# EAGLE design tb_project_arduino_pro_mini_proto_revA (EAGLE 7.6.0)
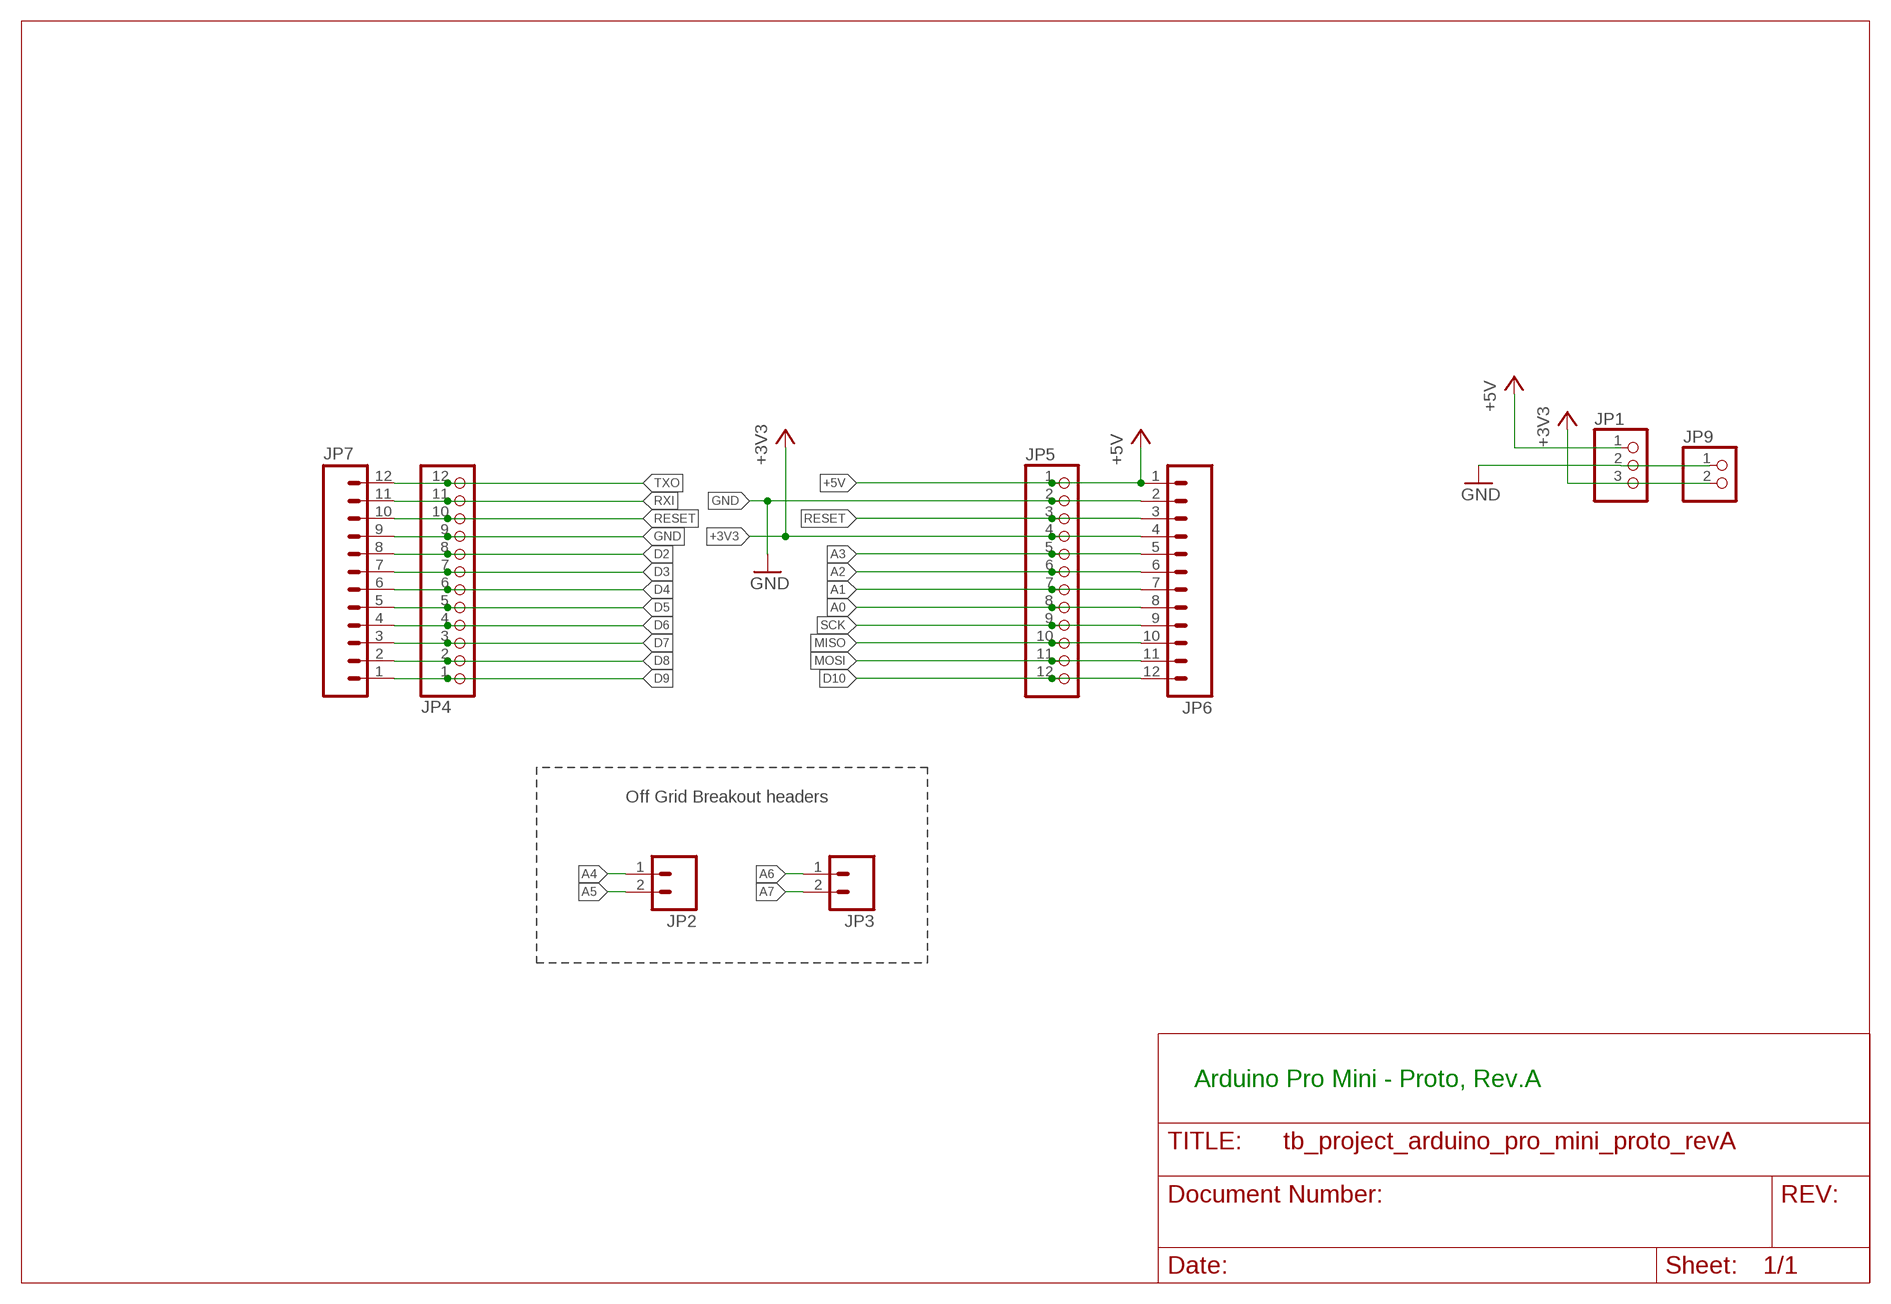
[diagram p0: schematic, sheet 1]

## Parts
JP1  PINHD-1X3  [1X03]
JP2  M02PTH  [1X02]
JP3  M02PTH  [1X02]
JP4  PINHD-1X12  [1X12]
JP5  PINHD-1X12  [1X12]
JP6  M12PTH  [1X12]
JP7  M12PTH  [1X12]
JP9  PINHD-1X2  [1X02]

## Nets
+3V3: JP1.3 JP5.4 JP6.4 JP9.2
+5V: JP1.1 JP5.1 JP6.1
A0: JP5.8 JP6.8
A1: JP5.7 JP6.7
A2: JP5.6 JP6.6
A3: JP5.5 JP6.5
A4: JP2.1
A5: JP2.2
A6: JP3.1
A7: JP3.2
D2: JP4.8 JP7.8
D3: JP4.7 JP7.7
D4: JP4.6 JP7.6
D5: JP4.5 JP7.5
D6: JP4.4 JP7.4
D7: JP4.3 JP7.3
D8: JP4.2 JP7.2
D9: JP4.1 JP7.1
D10: JP5.12 JP6.12
GND [vcc]: JP1.2 JP4.9 JP5.2 JP6.2 JP7.9 JP9.1
MISO: JP5.10 JP6.10
MOSI: JP5.11 JP6.11
RESET: JP4.10 JP5.3 JP6.3 JP7.10
RXI: JP4.11 JP7.11
SCK: JP5.9 JP6.9
TXO: JP4.12 JP7.12

## Notes on the sheet
- Off Grid Breakout headers
- Arduino Pro Mini - Proto, Rev.A

## Library data of the parts
JP1 = pinhead:PINHD-1X3: PIN HEADER
JP2 JP3 = SparkFun:M02: Header 2 Standard 2-pin 0.1" header. Use with straight break away headers (SKU : PRT-00116), right angle break away headers (PRT-00553), swiss pins (PRT-00743), machine pins (PRT-00117), and female headers (PRT-00115). Molex polarized connector foot print use with SKU : PRT-08233 with associated crimp pins and housings.
JP4 JP5 = pinhead:PINHD-1X12: PIN HEADER
JP6 JP7 = SparkFun:M12: Header 12 Standard 12-pin 0.1" header. Use with straight break away headers (SKU : PRT-00116), right angle break away headers (PRT-00553), swiss pins (PRT-00743), machine pins (PRT-00117), and female headers (PRT-00115).
JP9 = pinhead:PINHD-1X2: PIN HEADER

## Net classes
1 vcc: width 0.254 mm

## Board
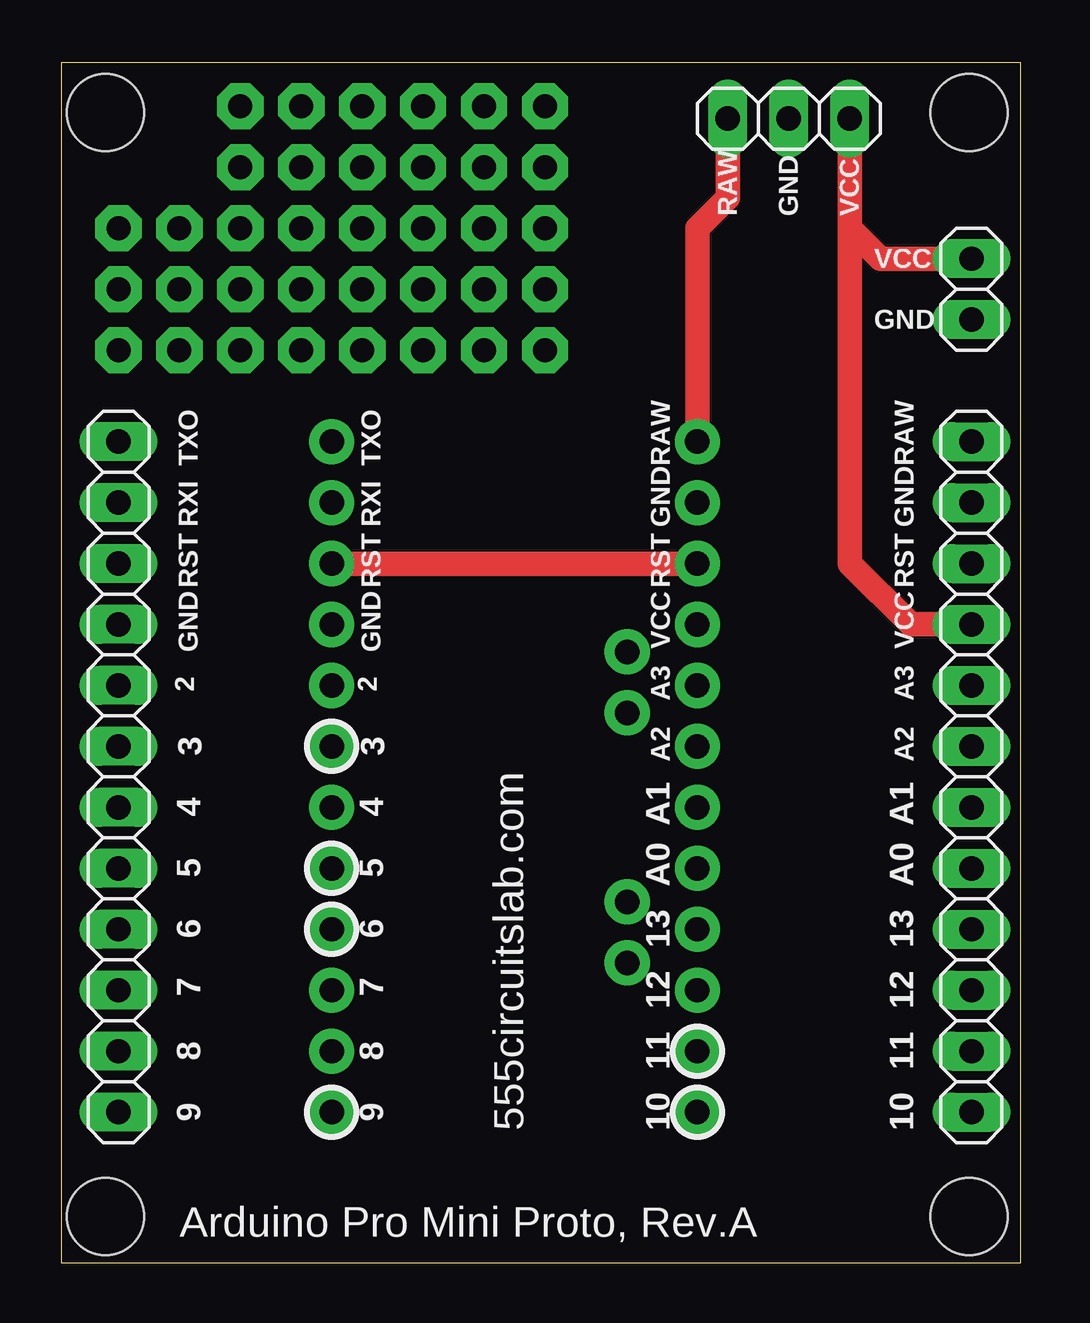
[diagram p1: board, top side]
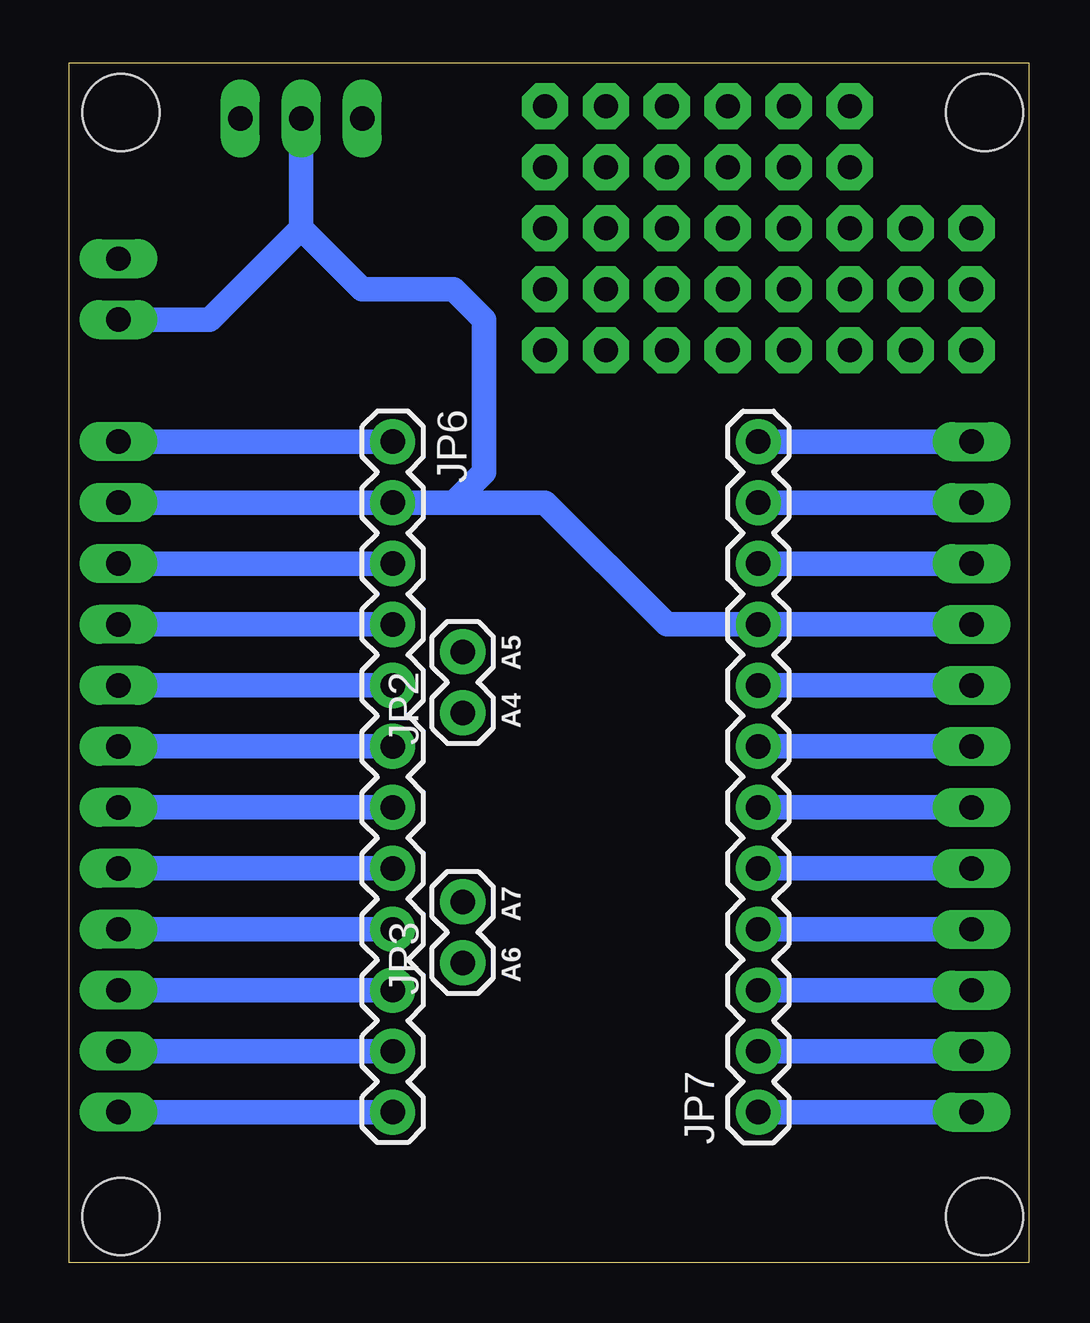
[diagram p2: board, bottom side, seen from below]

Size 40 x 50 mm. Coordinates in mm from the lower left corner, seen from the top.
Outline: 0,0 40,0 40,50 0,50 0,0
Copper layers (1*16): Top 0.035mm / dielectric 1.5mm / Bottom 0.035mm
Design rules "SparkFun-2-layer *": minimum track width 7mil, minimum drill 15mil, track to track 8mil, track to pad 8mil, pad to pad 8mil, via to via 8mil, smd to smd 8mil, copper to edge 8mil, drill to drill 8mil, minimum pad ring 12mil, minimum via ring 10mil, stop-mask expansion 4mil, vias tented up to drill 20mil, thermal gap 10mil
Holes 3.2 mm at 1.84,1.92 37.84,1.92 1.84,47.92 37.84,47.92

### Footprints (pad centres in the part's own frame; a part is rotated, then mirrored left to right if it is on the bottom)
1X03 = drill 1.016 long: 1 -2.54,0; 2 0,0; 3 2.54,0
1X02 = drill 1.016 pad 1.88: 1 0,0; 2 2.54,0
1X12 = drill 1.016 long: 1 -13.97,0; 2 -11.43,0; 3 -8.89,0; 4 -6.35,0; 5 -3.81,0; 6 -1.27,0; 7 1.27,0; 8 3.81,0; 9 6.35,0; 10 8.89,0; 11 11.43,0; 12 13.97,0
1X12' = drill 1.016 pad 1.88: 1 0,0; 2 2.54,0; 3 5.08,0; 4 7.62,0; 5 10.16,0; 6 12.7,0; 7 15.24,0; 8 17.78,0; 9 20.32,0; 10 22.86,0; 11 25.4,0; 12 27.94,0
1X02' = drill 1.016 long: 1 -1.27,0; 2 1.27,0

### Placement (x,y rotation side)
JP1  30.32,47.67 0 top
JP2  23.59,22.91 90 bottom
JP3  23.59,12.49 90 bottom
JP4  2.38,20.24 90 top
JP5  37.94,20.24 270 top
JP6  [1X12']  26.51,34.21 270 bottom
JP7  [1X12']  11.27,6.27 90 bottom
JP9  [1X02']  37.94,40.56 90 top

### Tracks (layer width: path | path; a pad name or v marks a point on that pad's centre or on a via)
+3V3
  Top 1.016: JP1.3 32.86,43.1 | 32.86,43.1 32.86,29.13 35.4,26.59 JP5.4 | JP9.2 34.13,41.83 32.86,43.1
  Bottom 1.016: JP6.4 JP5.4
+5V
  Top 1.016: JP1.1 27.78,44.37 26.51,43.1 JP6.1
  Bottom 1.016: JP6.1 JP5.1
A0
  Bottom 1.016: JP6.8 JP5.8
A1
  Bottom 1.016: JP6.7 JP5.7
A2
  Bottom 1.016: JP6.6 JP5.6
A3
  Bottom 1.016: JP6.5 JP5.5
D2
  Bottom 1.016: JP4.8 JP7.8
D3
  Bottom 1.016: JP4.7 JP7.7
D4
  Bottom 1.016: JP4.6 JP7.6
D5
  Bottom 1.016: JP4.5 JP7.5
D6
  Bottom 1.016: JP4.4 JP7.4
D7
  Bottom 1.016: JP4.3 JP7.3
D8
  Bottom 1.016: JP4.2 JP7.2
D9
  Bottom 1.016: JP4.1 JP7.1
D10
  Bottom 1.016: JP5.12 JP6.12
GND
  Bottom 1.016: JP4.9 JP7.9 15.08,26.59 20.16,31.67 23.97,31.67 | JP5.2 JP6.2 23.97,31.67 | JP1.2 30.32,43.1 | 30.32,43.1 27.78,40.56 23.97,40.56 22.7,39.29 22.7,32.94 23.97,31.67 | 30.32,43.1 34.13,39.29 JP9.1
MISO
  Bottom 1.016: JP6.10 JP5.10
MOSI
  Bottom 1.016: JP6.11 JP5.11
N$1  (via drill 1 pad 1.93)
  other vias: 7.46,45.64
N$2  (via drill 1 pad 1.93)
  other vias: 7.46,43.1
N$3  (via drill 1 pad 1.93)
  other vias: 10,40.56
N$4  (via drill 1 pad 1.93)
  other vias: 10,38.02
N$5  (via drill 1 pad 1.93)
  other vias: 12.54,38.02
N$6  (via drill 1 pad 1.93)
  other vias: 12.54,40.56
N$7  (via drill 1 pad 1.93)
  other vias: 12.54,43.1
N$8  (via drill 1 pad 1.93)
  other vias: 10,43.1
N$9  (via drill 1 pad 1.93)
  other vias: 10,45.64
N$10  (via drill 1 pad 1.93)
  other vias: 7.46,48.18
N$11  (via drill 1 pad 1.93)
  other vias: 10,48.18
N$12  (via drill 1 pad 1.93)
  other vias: 12.54,45.64
N$13  (via drill 1 pad 1.93)
  other vias: 12.54,48.18
N$14  (via drill 1 pad 1.93)
  other vias: 15.08,45.64
N$15  (via drill 1 pad 1.93)
  other vias: 15.08,48.18
N$16  (via drill 1 pad 1.93)
  other vias: 20.16,40.56
N$17  (via drill 1 pad 1.93)
  other vias: 20.16,48.18
N$18  (via drill 1 pad 1.93)
  other vias: 20.16,45.64
N$19  (via drill 1 pad 1.93)
  other vias: 20.16,43.1
N$20  (via drill 1 pad 1.93)
  other vias: 20.16,38.02
N$21  (via drill 1 pad 1.93)
  other vias: 15.08,38.02
N$22  (via drill 1 pad 1.93)
  other vias: 17.62,38.02
N$23  (via drill 1 pad 1.93)
  other vias: 15.08,40.56
N$24  (via drill 1 pad 1.93)
  other vias: 17.62,40.56
N$25  (via drill 1 pad 1.93)
  other vias: 15.08,43.1
N$26  (via drill 1 pad 1.93)
  other vias: 17.62,43.1
N$27  (via drill 1 pad 1.93)
  other vias: 17.62,45.64
N$119  (via drill 1 pad 1.93)
  other vias: 17.62,48.18
N$124  (via drill 1 pad 1.93)
  other vias: 4.92,40.56
N$125  (via drill 1 pad 1.93)
  other vias: 4.92,43.1
N$126  (via drill 1 pad 1.93)
  other vias: 2.38,40.56
N$127  (via drill 1 pad 1.93)
  other vias: 2.38,43.1
N$144  (via drill 1 pad 1.93)
  other vias: 2.38,38.02
N$152  (via drill 1 pad 1.93)
  other vias: 7.46,40.56
N$153  (via drill 1 pad 1.93)
  other vias: 7.46,38.02
N$154  (via drill 1 pad 1.93)
  other vias: 4.92,38.02
RESET
  Top 1.016: JP7.10 JP6.3
  Bottom 1.016: JP4.10 JP7.10 | JP5.3 JP6.3
RXI
  Bottom 1.016: JP4.11 JP7.11
SCK
  Bottom 1.016: JP6.9 JP5.9
TXO
  Bottom 1.016: JP4.12 JP7.12

### Text on the board
tPlace: RAW | GND | VCC | VCC | GND | TXO | TXO | RAW | RAW | RXI | RXI | GND | GND | RST | RST | RST | RST | GND | GND | VCC | VCC | 2 | 2 | A3 | A3 | 3 | 3 | A2 | A2 | 4 | 4 | A1 | A1 | 5 | 5 | A0 | A0 | 6 | 6 | 13 | 13 | 7 | 7 | 12 | 12 | 8 | 8 | 11 | 11 | 9 | 9 | 555circuitslab.com | 10 | 10 | Arduino Pro Mini Proto, Rev.A
bPlace: A5 | A4 | A7 | A6
tValues: Valid combinations: | 168V / 3.3V Reg / 8MHz | 168 / 5V Reg / 16MHz | 168 / 5V Reg / 20MHz | Mark back accordingly | Arduino Pro Mini